# Altium project can&rs485.PrjPcb
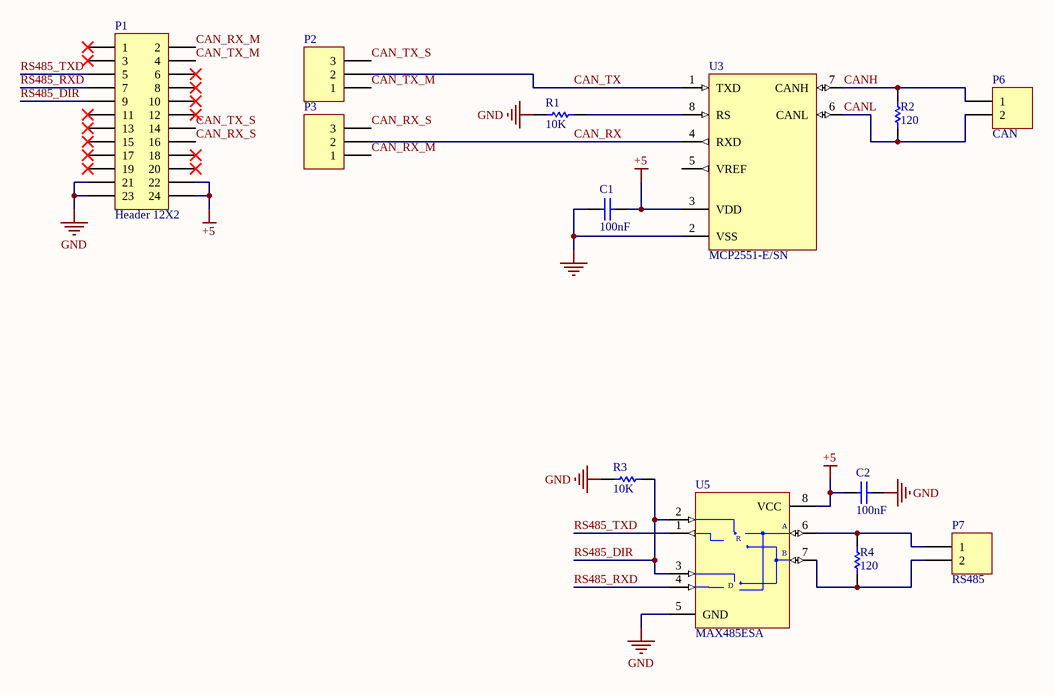
[diagram p0: can&rs485.SchDoc]
1 sheet, 13 parts. Net scope: global (net labels, ports and power ports of the same name join across sheets).
Board file: canRs485.PcbDoc

## Sheet can&rs485.SchDoc
size A

### Parts
C1  100nF  [CAPC4817X12N]
C2  100nF  [CAPC4817X12N]
P1  Header 12X2  [HDR2X12]
P2  Header 3  [HDR1X3]  (value not drawn)
P3  Header 3  [HDR1X3]  (value not drawn)
P6  CAN  [POWER]
P7  RS485  [POWER]
R1  10K  [RESC4817X04N]
R2  120  [RESC4817X04N]
R3  10K  [RESC4817X04N]
R4  120  [RESC4817X04N]
U3  MCP2551-E/SN  [SOIC-SN8_N]
U5  MAX485ESA  [NSO8_N]

### Nets
+5: C1.2 C2.1 P1.22 P1.24 U3.3(VDD) U5.8(VCC)
GND: C1.1 C2.2 P1.21 P1.23 R1.2 R3.2 U3.2(VSS) U5.5(GND)
CAN_RX: P3.2 U3.4(RXD)
CAN_RX_M: P1.2 P3.1
CAN_RX_S: P1.16 P3.3
CAN_TX: P2.2 U3.1(TXD)
CAN_TX_M: P1.4 P2.1
CAN_TX_S: P1.14 P2.3
CANH: P6.1 R2.2 U3.7(CANH)
CANL: P6.2 R2.1 U3.6(CANL)
RS485_DIR: P1.9 R3.1 U5.2(~{RE}) U5.3(DE)
RS485_RXD: P1.7 U5.4(DI)
RS485_TXD: P1.5 U5.1(RO)
NetP7_1: P7.1 R4.2 U5.6(A)
NetP7_2: P7.2 R4.1 U5.7(B)
NetR1_1: R1.1 U3.8(RS)

Not connected (* = marked no-connect by the designer): P1 1* 3* 6* 8* 10* 11* 12* 13* 15* 17* 18* 19* 20*; U3 5(VREF)

### Notes on the sheet
- (in symbol MAX485ESA) R; D

### Library data of the parts
C1 C2 = CAP: Capacitor; Published: 8-Jun-2000; Revision: July-2002: Re-released for DXP Platform.; Publisher: Altium Limited; Value: 100nF
P1 = Header 12X2: Header, 12-Pin, Dual row; LatestRevisionDate: 17-Jul-2002; LatestRevisionNote: Re-released for DXP Platform.; Publisher: Altium Limited
P2 P3 = Header 3: Header, 3-Pin; LatestRevisionDate: 17-Jul-2002; LatestRevisionNote: Re-released for DXP Platform.; Publisher: Altium Limited
P6 P7 = Header 2: Header, 2-Pin; LatestRevisionDate: 17-Jul-2002; LatestRevisionNote: Re-released for DXP Platform.; Publisher: Altium Limited
R1-R4 = res1: Resistor; Published: 8-Jun-2000; Revision: July-2002: Re-released for DXP Platform.; Publisher: Altium Limited
  R1 R3: Value: 10K
  R2 R4: Value: 120
U3 = MCP2551-E/SN: High-Speed CAN Transceiver, 8-Pin SOIC, Extended Temperature; Manufacturer: Microchip; DatasheetVersion: revF, Jul-2010; PackageVersion: revBB, Aug-2009; PackageReference: SOIC-SN8; PackageDescription: 8-Lead Plastic Small Outline (SN) - Narrow, 3.90mm Body [SOIC]; Supplier 1: Digi-Key; Supplier Part Number 1: MCP2551-E/SN-ND; Supplier 2: Farnell; Supplier Part Number 2: 1467746; Supplier 3: Newark; Supplier Part Number 3: 92C4186; Supplier 4: Mouser; Supplier Part Number 4: 579-MCP2551-E/SN; Mounting Technology: Surface Mount; Code_JEDEC: MS-012; Code_IPC: SOIC127P600-8; PartNumber: MCP2551-E/SN; ComponentLink1Description: Manufacturer URL; ComponentLink1URL: http://www.microchip.com/; ComponentLink2Description: Datasheet; ComponentLink2URL: http://ww1.microchip.com/downloads/en/DeviceDoc/21667F.pdf; ComponentLink3Description: Package Specification; ComponentLink3URL: http://www.microchip.com/stellent/groups/techpub_sg/documents/packagingspec/en012702.pdf
U5 = MAX485ESA: Low-Power, Slew-Rate-Limited RS-485/RS-422 Transceiver; Published: 16-Jan-2001; LatestRevisionDate: 13-Apr-2006; LatestRevisionNote: IPC-7351 Footprint Added.; DatasheetVersion: Feb-1996; PackageReference: NSO8; Publisher: Altium Limited; PackageDescription: 8-Pin Small Outline Integrated Circuit 1.27 mm Pitch; Code_JEDEC: MS-012-AA; Code_IPC: SOIC127P600-8; ComponentLink1Description: Manufacturer Link; ComponentLink1URL: http://www.maxim-ic.com/; ComponentLink2Description: Datasheet; ComponentLink2URL: http://pdfserv.maxim-ic.com/en/ds/MAX1487-MAX491.pdf